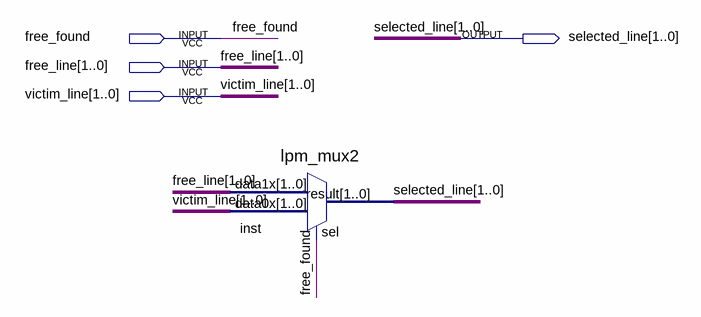
[diagram p0: schematic sheet]
// Quartus schematic free_or_lru_select.bdf as structural Verilog: 1 symbols, 4 pins
module free_or_lru_select (
  input  free_found,
  input  [1:0] free_line,
  input  [1:0] victim_line,
  output [1:0] selected_line
);

  lpm_mux2 inst (.data1x(free_line), .data0x(victim_line), .sel(free_found), .result(selected_line));
endmodule
